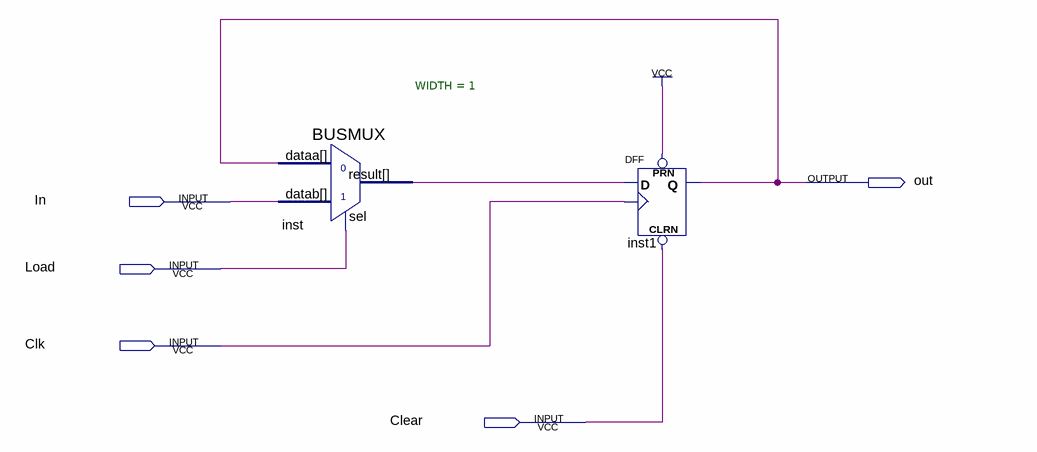
[diagram p0: schematic sheet]
// Quartus schematic register.bdf as structural Verilog: 2 symbols, 5 pins
module register (
  input  In,
  input  Load,
  input  Clk,
  input  Clear,
  output out
);

  wire inst_result;

  BUSMUX #(.WIDTH(1)) inst (.datab(In), .sel(Load), .dataa(out), .result(inst_result));
  DFF inst1 (.CLRN(Clear), .CLK(Clk), .D(inst_result), .PRN(1'b1), .Q(out));
endmodule
